# EAGLE schematic Eagle schematic (EAGLE 7.4.0)
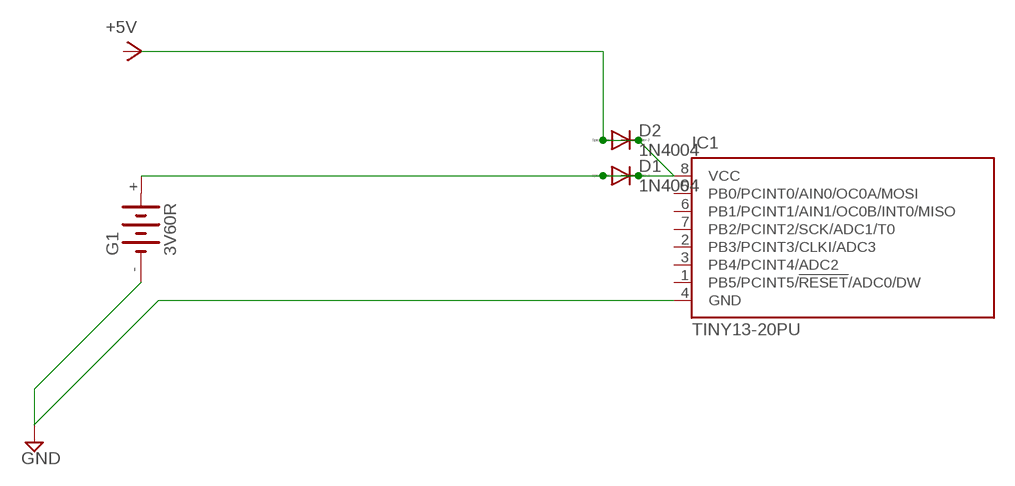
[diagram p0: schematic, sheet 1]

## Parts
D1  1N4004  [DO41-10]
D2  1N4004  [DO41-10]
G1  3V60R  [3V60R]
IC1  TINY13-20PU  [DIL08]

## Nets
GND: G1.- IC1.4(GND)
N$1: D1.A D1.C D2.A D2.C G1.+ IC1.8(VCC)
Unconnected: G1.+@1(+) IC1.1(PB5/PCINT5/!RESET!/ADC0/DW) IC1.2(PB3/PCINT3/CLKI/ADC3) IC1.3(PB4/PCINT4/ADC2) IC1.5(PB0/PCINT0/AIN0/OC0A/MOSI) IC1.6(PB1/PCINT1/AIN1/OC0B/INT0/MISO) IC1.7(PB2/PCINT2/SCK/ADC1/T0)

## Library data of the parts
D1 D2 = diode:1N4004: DIODE general purpose rectifier, 1 A
G1 = battery:3V60R: NC ACCU Varta
IC1 = atmel:TINY13: 8-bit AVR Microcontroller with 1K Bytes In-System Programmable Flash Source: http://www.atmel.com/dyn/resources/prod_documents/2535S.pdf; MPN: ATTINY13-20PU; OC_FARNELL: 9171550; OC_NEWARK: 96K6521